# EAGLE schematic p2n-001 (EAGLE 9.6.2)
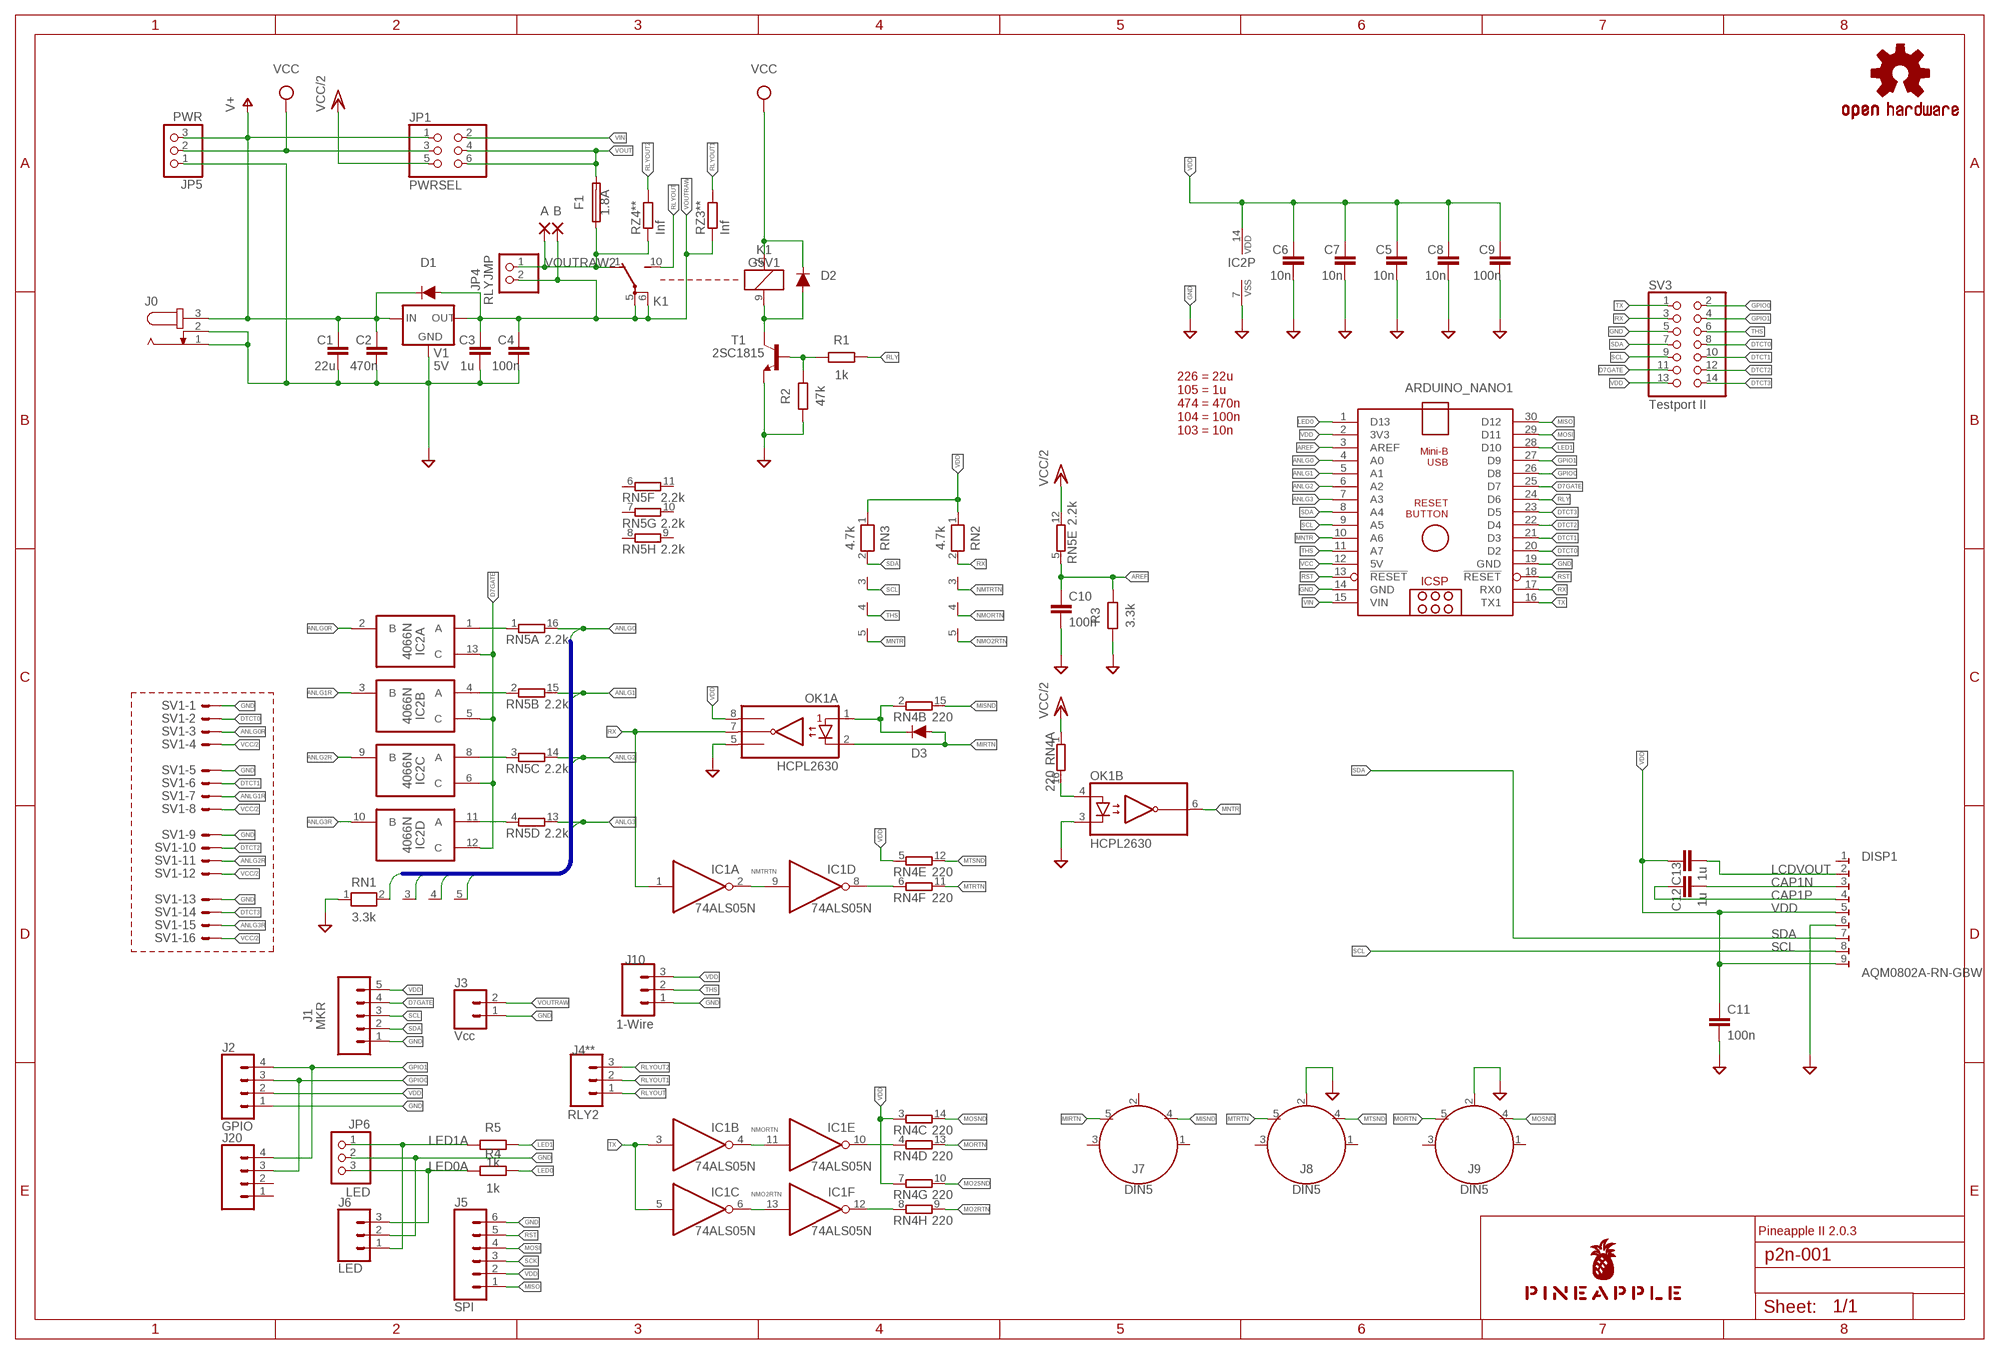
[diagram p0: schematic, sheet 1]

## Parts
A  SMD2  [SMD1,27-2,54]
ARDUINO_NANO1  ARDUINO_NANO  [ARDUINO_NANO]
B  SMD2  [SMD1,27-2,54]
C1  22u  C-EU025-050X050  [C025-050X050]
C2  470n  C-EU050-024X044  [C050-024X044]
C3  1u  C-EU050-024X044  [C050-024X044]
C4  100n  C-EU025-024X044  [C025-024X044]
C5  10n  C-EU025-024X044  [C025-024X044]
C6  10n  C-EU025-024X044  [C025-024X044]
C7  10n  C-EU025-024X044  [C025-024X044]
C8  10n  C-EU025-024X044  [C025-024X044]
C9  100n  C-EU025-024X044  [C025-024X044]
C10  100n  C-EU025-024X044  [C025-024X044]
C11  100n  C-EU025-024X044  [C025-024X044]
C12  1u  C-EU050-024X044  [C050-024X044]
C13  1u  C-EU050-024X044  [C050-024X044]
D1  DIODE-1N4148  [DIODE-1N4148]
D2  DIODE-1N4148  [DIODE-1N4148]
D3  DIODE-1N4148  [DIODE-1N4148]
DISP1  AQM0802A-RN-GBW  [AQM0802A-RN-GBW-FOOTPRINT]
F1  1.8A  TE5  [TE5]
IC1  74ALS05N  [DIL14]
IC2  4066N  [DIL14]
J0  JACK-PLUG0  [SPC4077]
J1  MKR  CONN_05JST  [JST-5-PTH]
J2  GPIO  CONN_04JST-PTH  [JST-4-PTH]
J3  Vcc  CONN_02JST-PTH-2  [JST-2-PTH]
J4**  RLY2  CONN_03JST-PTH-NS  [JST-3-PTH-NS]
J5  SPI  CONN_061.27MM  [1X06_1.27MM]
J6  LED  CONN_03JST-PTH-VERT  [JST-3-PTH-VERT]
J7  DIN5  [DIN5-RA-PTH]
J8  DIN5  [DIN5-RA-PTH]
J9  DIN5  [DIN5-RA-PTH]
J10  1-Wire  CONN_03JST-PTH-VERT  [JST-3-PTH-VERT]
J20  CONN_041.27MM  [1X04_1.27MM]
JP1  PWRSEL  PINHD-2X3  [2X03]
JP4  RLYJMP  PINHD-1X2  [1X02]
JP5  PWR  PINHD-1X3  [1X03]
JP6  LED  PINHD-1X3  [1X03]
K1  G5V1  [G5V1]
LOGO1  OSHW-LOGOS-COPPER  [OSHW-LOGO-S_COPPER]
OK1  HCPL2630  [DIL08]
R1  1k  R-EU_0204/5  [0204/5]
R2  47k  R-EU_0204/5  [0204/5]
R3  3.3k  R-EU_0204/5  [0204/5]
R4  1k  R-EU_0204/5  [0204/5]
R5  1k  R-EU_0204/5  [0204/5]
RN1  3.3k  RN04  [RN-5]
RN2  4.7k  RN04  [RN-5]
RN3  4.7k  RN04  [RN-5]
RN4  220  8R-N  [DIL16]
RN5  2.2k  8R-N  [DIL16]
RZ3**  Inf  R-EU_M2012  [M2012]
RZ4**  Inf  R-EU_M2012  [M2012]
SV1  ML16LE  [ML16L]
SV3  Testport II  PINHD-2X7  [2X07]
T1  2SC1815  [TO92-ECB]
U$1  PINEAPPLE450_SILK  [PINEAPPLE450_SILK]
V1  5V  78XXL  [78XXL]

## Nets
ANLG0 [analog]: ARDUINO_NANO1.4(A0) RN1.2 RN5.16
ANLG0R [analog]: IC2.2(A:B) SV1.3
ANLG1 [analog]: ARDUINO_NANO1.5(A1) RN1.3 RN5.15
ANLG1R [analog]: IC2.3(B:B) SV1.7
ANLG2 [analog]: ARDUINO_NANO1.6(A2) RN1.4 RN5.14
ANLG2R [analog]: IC2.9(C:B) SV1.11
ANLG3 [analog]: ARDUINO_NANO1.7(A3) RN1.5 RN5.13
ANLG3R [analog]: IC2.10(D:B) SV1.15
AREF: ARDUINO_NANO1.3(AREF) C10.1 R3.2 RN5.5
CAP1N: C12.2 DISP1.3
CAP1P: C12.1 DISP1.4
D7GATE: ARDUINO_NANO1.25(D7) IC2.5(B:C) IC2.6(C:C) IC2.12(D:C) IC2.13(A:C) J1.4 SV3.11
DTCT0: ARDUINO_NANO1.20(D2) SV1.2 SV3.8
DTCT1: ARDUINO_NANO1.21(D3) SV1.6 SV3.10
DTCT2: ARDUINO_NANO1.22(D4) SV1.10 SV3.12
DTCT3: ARDUINO_NANO1.23(D5) SV1.14 SV3.14
GND [gnd]: ARDUINO_NANO1.14(GND) ARDUINO_NANO1.19(GND) C1.2 C2.2 C3.2 C4.2 C5.2 C6.2 C7.2 C8.2 C9.2 C10.2 C11.2 DISP1.6 IC2.7(P:VSS) J0.1 J0.2 J1.1 J2.1 J3.1 J5.6 J6.2 J8.2 J9.2 J10.1 JP5.1 JP6.2 OK1.3(B:C2) OK1.5(A:GND) R2.1 R3.1 RN1.1 SV1.1 SV1.5 SV1.9 SV1.13 SV3.5 T1.E V1.GND
GPIO0: ARDUINO_NANO1.26(D8) J2.3 J20.3 SV3.2
GPIO1: ARDUINO_NANO1.27(D9) J2.4 J20.4 SV3.4
LCDVOUT: C13.2 DISP1.2
LED0: ARDUINO_NANO1.1(D13) R4.2
LED0A: J6.3 JP6.3 R4.1
LED1: ARDUINO_NANO1.28(D10) R5.2
LED1A: J6.1 JP6.1 R5.1
MIDIINSND: D3.C OK1.1(A:A1) RN4.2
MIRTN: D3.A J7.5 OK1.2(A:C1)
MISND: J7.4 RN4.15
MISO: ARDUINO_NANO1.30(D12) J5.1
MNTR: ARDUINO_NANO1.10(A6) OK1.6(B:VO2) RN3.5
MNTRA: OK1.4(B:A2) RN4.16
MO2RTN: RN4.9
MO2RTNRAW: IC1.12(F:O) RN4.8
MO2SND: RN4.10
MORTN: J9.5 RN4.13
MORTNRAW: IC1.10(E:O) RN4.4
MOSI: ARDUINO_NANO1.29(D11) J5.4
MOSND: J9.4 RN4.14
MTRTN: J8.5 RN4.11
MTRTNRAW: IC1.8(D:O) RN4.6
MTSND: J8.4 RN4.12
N$1: IC2.1(A:A) RN5.1
N$2: IC2.4(B:A) RN5.2
N$3: IC2.8(C:A) RN5.3
N$4: IC2.11(D:A) RN5.4
NMO2RTN: IC1.6(C:O) IC1.13(F:I) RN2.5
NMORTN: IC1.4(B:O) IC1.11(E:I) RN2.4
NMTRTN: IC1.2(A:O) IC1.9(D:I) RN2.3
RLY: ARDUINO_NANO1.24(D6) R1.2
RLYDRV: R1.1 R2.2 T1.B
RLYOUT: J4**.1 K1.10(2:S)
RLYOUT1: J4**.2 RZ3**.2
RLYOUT2: J4**.3 RZ4**.2
RLYSNK: D2.A K1.9 T1.C
RST: ARDUINO_NANO1.13(!RESET) ARDUINO_NANO1.18(!RESET) J5.5
RX: ARDUINO_NANO1.17(RX0) IC1.1(A:I) OK1.7(A:VO1) RN2.2 SV3.3
SCK: J5.3
SCL: ARDUINO_NANO1.9(A5) DISP1.8 J1.3 RN3.3 SV3.9
SDA: ARDUINO_NANO1.8(A4) DISP1.7 J1.2 RN3.2 SV3.7
THS: ARDUINO_NANO1.11(A7) J10.2 RN3.4 SV3.6
TX: ARDUINO_NANO1.16(TX1) IC1.3(B:I) IC1.5(C:I) SV3.1
V+ [superpower]: C1.1 C2.1 D1.C J0.3 JP1.1 JP5.3 V1.IN
VCC [power]: ARDUINO_NANO1.12(5V) D2.C JP1.3 JP5.2 K1.2
VCC/2 [superpower]: JP1.5 RN4.1 RN5.12 SV1.4 SV1.8 SV1.12 SV1.16
VDD [power]: ARDUINO_NANO1.2(3V3) C5.1 C6.1 C7.1 C8.1 C9.1 C11.1 C13.1 DISP1.5 DISP1.9 IC2.14(P:VDD) J1.5 J2.2 J5.2 J10.3 OK1.8(A:VCC) RN2.1 RN3.1 RN4.3 RN4.5 RN4.7 SV3.13
VIN [superpower]: ARDUINO_NANO1.15(VIN) JP1.2
VOUT [superpower]: F1.2 JP1.4 JP1.6
VOUTRAW [superpower]: B.1(P) C3.1 C4.1 D1.A J3.2 JP4.2 K1.5(2:P) K1.6(2:P) RZ3**.1 V1.OUT
VOUTRAW2 [superpower]: A.1(P) F1.1 JP4.1 K1.1(2:O) RZ4**.1
Unconnected: DISP1.1 J7.1 J7.2 J7.3 J8.1 J8.3 J9.1 J9.3 J20.1 J20.2 RN5.6 RN5.7 RN5.8 RN5.9 RN5.10 RN5.11

## Buses
ANLG[0..3]

## Notes on the sheet
- 226 = 22u
  105 = 1u
  474 = 470n
  104 = 100n
  103 = 10n
- Pineapple II 2.0.3

## Power pins joined to a net without a drawn wire
GND: IC1.7(P:GND)
VCC: IC1.14(P:VCC)

## Library data of the parts
A B = wirepad:SMD2: SMD PAD
ARDUINO_NANO1 = ArduinoNanoV30:ARDUINO_NANO: Arduino Nano V3.0 Overview: The Arduino Nano is a small, complete, and breadboard-friendly board based on the ATmega328 (Arduino Nano 3.x) or ATmega168 (Arduino Nano 2.x). It has more or less the same functionality of the Arduino Duemilanove, but in a different package. It lacks only a DC power jack, and works with a Mini-B USB cable instead of a standard one. The Nano was designed and is being produced by Gravitech. Specifications: Microcontroller Atmel ATmega168 or ATmega328 Operating Voltage (logic level) 5 V Input Voltage (recommended) 7-12 V Input Voltage (limits) 6-20 V Digital I/O Pins 14 (of which 6 provide PWM output) Analog Input Pins 8 DC Current per I/O Pin 40 mA Flash Memory 16 KB (ATmega168) or 32 KB (ATmega328) of which 2 KB used by bootloader SRAM 1 KB (ATmega168) or 2 KB (ATmega328) EEPROM 512 bytes (ATmega168) or 1 KB (ATmega328) Clock Speed 16 MHz Dimensions 0.73" x 1.70" Length 45 mm Width 18 mm Weigth 5 g Power: The Arduino Nano can be powered via the Mini-B USB connection, 6-20V unregulated external power supply (pin 30), or 5V regulated external power supply (pin 27). The power source is automatically selected to the highest voltage source. Memory: The ATmega168 has 16 KB of flash memory for storing code (of which 2 KB is used for the bootloader); the ATmega328 has 32 KB, (also with 2 KB used for the bootloader). The ATmega168 has 1 KB of SRAM and 512 bytes of EEPROM (which can be read and written with the EEPROM library); the ATmega328 has 2 KB of SRAM and 1 KB of EEPROM. Input and Output: Each of the 14 digital pins on the Nano can be used as an input or output, using pinMode(), digitalWrite(), and digitalRead() functions. They operate at 5 volts. Each pin can provide or receive a maximum of 40 mA and has an internal pull-up resistor (disconnected by default) of 20-50 kOhms. In addition, some pins have specialized functions. Visit Arduino - ArduinoBoardNano <https://www.arduino.cc/en/Main/ArduinoBoardNano>
C1-C4 C10-C13 = rcl:C-EU: CAPACITOR, European symbol; SPICEPREFIX: C
C5-C9 = resistor:C-EU: CAPACITOR, European symbol
D1-D3 = SparkFun-DiscreteSemi:DIODE: Diode These are standard reverse protection diodes and small signal diodes. SparkFun Products: SparkFun SparkPunk Sound Kit <https://www.sparkfun.com/products/11177> SparkFun ESP8266 Thing <https://www.sparkfun.com/products/13231>; PROD_ID: DIO-08378; VALUE: 200mA/100V/1V
DISP1 = AQM0802A-RN-GBW:AQM0802A-RN-GBW: AQM0802A-RN-GBW LCD
F1 = fuse:TE5: FUSE Wickmann; OC_FARNELL: unknown; OC_NEWARK: unknown
IC1 = 74xx-us:74*05: Hex INVERTER, open collector
IC2 = 40xx:4066: Quad bilateral ANALOG SWITCH
J0 = con-jack:JACK-PLUG: DC POWER JACK Power Jack, DC, Right Angle, Through Hole, Rated 5A at 16VDC, PC Terminals Distributor: Farnell (www.Farnell.de) Drawing: 84N1161.pdf / 84N1162.pdf Manufacturer: SPC Technology (www.spctechnology.com) Type: SPC4077 / SPC 4078; OC_FARNELL: unknown; OC_NEWARK: unknown
J1 = SparkFun-Connectors:CONN_05: Multi connection point. Often used as Generic Header-pin footprint for 0.1 inch spaced/style header connections On any of the 0.1 inch spaced packages, you can populate with these: Break Away Headers - Straight <https://www.sparkfun.com/products/116> (PRT-00116) Break Away Male Headers - Right Angle <https://www.sparkfun.com/products/553> (PRT-00553) Female Headers <https://www.sparkfun.com/products/115> (PRT-00115) Break Away Headers - Machine Pin <https://www.sparkfun.com/products/117> (PRT-00117) Break Away Female Headers - Swiss Machine Pin <https://www.sparkfun.com/products/743> (PRT-00743) For SCREWTERMINALS and SPRING TERMINALS visit here: Screw Terimnals on SparkFun.com <https://www.sparkfun.com/search/results?term=Screw+Terminals> (5mm/3.5mm/2.54mm spacing) This device is also useful as a general connection point to wire up your design to another part of your project. Our various solder wires solder well into these plated through hole pads. Hook-Up Wire - Assortment (Stranded, 22 AWG) <https://www.sparkfun.com/products/11375> (PRT-11375) Hook-Up Wire - Assortment (Solid Core, 22 AWG) <https://www.sparkfun.com/products/11367> (PRT-11367) View the entire wire category on our website here <https://www.sparkfun.com/categories/141> Special notes: Molex polarized connector foot print use with SKU : PRT-08231 with associated crimp pins and housings. 1MM SMD Version SKU: PRT-10208; SF_ID: PRT-09917
J2 = SparkFun-Connectors:CONN_04: Multi connection point. Often used as Generic Header-pin footprint for 0.1 inch spaced/style header connections On any of the 0.1 inch spaced packages, you can populate with these: Break Away Headers - Straight <https://www.sparkfun.com/products/116> (PRT-00116) Break Away Male Headers - Right Angle <https://www.sparkfun.com/products/553> (PRT-00553) Female Headers <https://www.sparkfun.com/products/115> (PRT-00115) Break Away Headers - Machine Pin <https://www.sparkfun.com/products/117> (PRT-00117) Break Away Female Headers - Swiss Machine Pin <https://www.sparkfun.com/products/743> (PRT-00743) For SCREWTERMINALS and SPRING TERMINALS visit here: Screw Terimnals on SparkFun.com <https://www.sparkfun.com/search/results?term=Screw+Terminals> (5mm/3.5mm/2.54mm spacing) This device is also useful as a general connection point to wire up your design to another part of your project. Our various solder wires solder well into these plated through hole pads. Hook-Up Wire - Assortment (Stranded, 22 AWG) <https://www.sparkfun.com/products/11375> (PRT-11375) Hook-Up Wire - Assortment (Solid Core, 22 AWG) <https://www.sparkfun.com/products/11367> (PRT-11367) View the entire wire category on our website here <https://www.sparkfun.com/categories/141> Special notes: Molex polarized connector foot print use with SKU : PRT-08231 with associated crimp pins and housings. 1MM SMD Version SKU: PRT-10208; PROD_ID: WIRE-13531; SF_ID: PRT-09916
J3 = SparkFun-Connectors:CONN_02: Multi connection point. Often used as Generic Header-pin footprint for 0.1 inch spaced/style header connections On any of the 0.1 inch spaced packages, you can populate with these: Break Away Headers - Straight <https://www.sparkfun.com/products/116> (PRT-00116) Break Away Male Headers - Right Angle <https://www.sparkfun.com/products/553> (PRT-00553) Female Headers <https://www.sparkfun.com/products/115> (PRT-00115) Break Away Headers - Machine Pin <https://www.sparkfun.com/products/117> (PRT-00117) Break Away Female Headers - Swiss Machine Pin <https://www.sparkfun.com/products/743> (PRT-00743) For SCREWTERMINALS and SPRING TERMINALS visit here: Screw Terimnals on SparkFun.com <https://www.sparkfun.com/search/results?term=Screw+Terminals> (5mm/3.5mm/2.54mm spacing) This device is also useful as a general connection point to wire up your design to another part of your project. Our various solder wires solder well into these plated through hole pads. Hook-Up Wire - Assortment (Stranded, 22 AWG) <https://www.sparkfun.com/products/11375> (PRT-11375) Hook-Up Wire - Assortment (Solid Core, 22 AWG) <https://www.sparkfun.com/products/11367> (PRT-11367) View the entire wire category on our website here <https://www.sparkfun.com/categories/141> Special notes: Molex polarized connector foot print use with: PRT-08233 with associated crimp pins and housings. 2.54_SCREWTERM for use with PRT-10571. 3.5mm Screw Terminal footprints for PRT-08084 5mm Screw Terminal footprints for use with PRT-08432; PROD_ID: CONN-09863; SKU: PRT-09914
J4** = SparkFun-Connectors:CONN_03: Multi connection point. Often used as Generic Header-pin footprint for 0.1 inch spaced/style header connections On any of the 0.1 inch spaced packages, you can populate with these: Break Away Headers - Straight <https://www.sparkfun.com/products/116> (PRT-00116) Break Away Male Headers - Right Angle <https://www.sparkfun.com/products/553> (PRT-00553) Female Headers <https://www.sparkfun.com/products/115> (PRT-00115) Break Away Headers - Machine Pin <https://www.sparkfun.com/products/117> (PRT-00117) Break Away Female Headers - Swiss Machine Pin <https://www.sparkfun.com/products/743> (PRT-00743) Stackable Header - 3 Pin (Female, 0.1") <https://www.sparkfun.com/products/13875> (PRT-13875) For SCREWTERMINALS and SPRING TERMINALS visit here: Screw Terimnals on SparkFun.com <https://www.sparkfun.com/search/results?term=Screw+Terminals> (5mm/3.5mm/2.54mm spacing) This device is also useful as a general connection point to wire up your design to another part of your project. Our various solder wires solder well into these plated through hole pads. Hook-Up Wire - Assortment (Stranded, 22 AWG) <https://www.sparkfun.com/products/11375> (PRT-11375) Hook-Up Wire - Assortment (Solid Core, 22 AWG) <https://www.sparkfun.com/products/11367> (PRT-11367) View the entire wire category on our website here <https://www.sparkfun.com/categories/141> Special notes: Molex polarized connector foot print use with SKU : PRT-08232 with associated crimp pins and housings.
J5 = SparkFun-Connectors:CONN_06: Multi connection point. Often used as Generic Header-pin footprint for 0.1 inch spaced/style header connections On any of the 0.1 inch spaced packages, you can populate with these: Break Away Headers - Straight <https://www.sparkfun.com/products/116> (PRT-00116) Break Away Male Headers - Right Angle <https://www.sparkfun.com/products/553> (PRT-00553) Female Headers <https://www.sparkfun.com/products/115> (PRT-00115) Break Away Headers - Machine Pin <https://www.sparkfun.com/products/117> (PRT-00117) Break Away Female Headers - Swiss Machine Pin <https://www.sparkfun.com/products/743> (PRT-00743) Arduino Stackable Header - 6 Pin <https://www.sparkfun.com/products/9280> (PRT-09280) For SCREWTERMINALS and SPRING TERMINALS visit here: Screw Terimnals on SparkFun.com <https://www.sparkfun.com/search/results?term=Screw+Terminals> (5mm/3.5mm/2.54mm spacing) This device is also useful as a general connection point to wire up your design to another part of your project. Our various solder wires solder well into these plated through hole pads. Hook-Up Wire - Assortment (Stranded, 22 AWG) <https://www.sparkfun.com/products/11375> (PRT-11375) Hook-Up Wire - Assortment (Solid Core, 22 AWG) <https://www.sparkfun.com/products/11367> (PRT-11367) View the entire wire category on our website here <https://www.sparkfun.com/categories/141>
J6 J10 = SparkFun-Connectors:CONN_03: Multi connection point. Often used as Generic Header-pin footprint for 0.1 inch spaced/style header connections On any of the 0.1 inch spaced packages, you can populate with these: Break Away Headers - Straight <https://www.sparkfun.com/products/116> (PRT-00116) Break Away Male Headers - Right Angle <https://www.sparkfun.com/products/553> (PRT-00553) Female Headers <https://www.sparkfun.com/products/115> (PRT-00115) Break Away Headers - Machine Pin <https://www.sparkfun.com/products/117> (PRT-00117) Break Away Female Headers - Swiss Machine Pin <https://www.sparkfun.com/products/743> (PRT-00743) Stackable Header - 3 Pin (Female, 0.1") <https://www.sparkfun.com/products/13875> (PRT-13875) For SCREWTERMINALS and SPRING TERMINALS visit here: Screw Terimnals on SparkFun.com <https://www.sparkfun.com/search/results?term=Screw+Terminals> (5mm/3.5mm/2.54mm spacing) This device is also useful as a general connection point to wire up your design to another part of your project. Our various solder wires solder well into these plated through hole pads. Hook-Up Wire - Assortment (Stranded, 22 AWG) <https://www.sparkfun.com/products/11375> (PRT-11375) Hook-Up Wire - Assortment (Solid Core, 22 AWG) <https://www.sparkfun.com/products/11367> (PRT-11367) View the entire wire category on our website here <https://www.sparkfun.com/categories/141> Special notes: Molex polarized connector foot print use with SKU : PRT-08232 with associated crimp pins and housings.; PROD_ID: CONN-13230
J7-J9 = SparkFun-Connectors:DIN5: DIN5 Connector - Female Right Angle (frequently used as a MIDI Jack connector) This type of connector and cable is frequently used for transmitting midi data (musical instrument digital interface). It is what you usually see on a keyboard or set of electronic drums. Learn more here <https://en.wikipedia.org/wiki/MIDI>. For more information on the pinout and electrical specifications of MIDI communications, please see the following resource: https://www.midi.org/specifications/item/midi-din-electrical-specification Here is the connector we sell at SparkFun: MIDI Connector - Female Right Angle <https://www.sparkfun.com/products/9536> (PRT-09536) Datasheet <hhttp://www.sparkfun.com/datasheets/Prototyping/Connectors/MIDI-RA.pdf> It is used on this SparkFun product: SparkFun MIDI Shield <https://www.sparkfun.com/products/12898> (DEV-12898); PROD_ID: CONN-09481
J20 = SparkFun-Connectors:CONN_04: Multi connection point. Often used as Generic Header-pin footprint for 0.1 inch spaced/style header connections On any of the 0.1 inch spaced packages, you can populate with these: Break Away Headers - Straight <https://www.sparkfun.com/products/116> (PRT-00116) Break Away Male Headers - Right Angle <https://www.sparkfun.com/products/553> (PRT-00553) Female Headers <https://www.sparkfun.com/products/115> (PRT-00115) Break Away Headers - Machine Pin <https://www.sparkfun.com/products/117> (PRT-00117) Break Away Female Headers - Swiss Machine Pin <https://www.sparkfun.com/products/743> (PRT-00743) For SCREWTERMINALS and SPRING TERMINALS visit here: Screw Terimnals on SparkFun.com <https://www.sparkfun.com/search/results?term=Screw+Terminals> (5mm/3.5mm/2.54mm spacing) This device is also useful as a general connection point to wire up your design to another part of your project. Our various solder wires solder well into these plated through hole pads. Hook-Up Wire - Assortment (Stranded, 22 AWG) <https://www.sparkfun.com/products/11375> (PRT-11375) Hook-Up Wire - Assortment (Solid Core, 22 AWG) <https://www.sparkfun.com/products/11367> (PRT-11367) View the entire wire category on our website here <https://www.sparkfun.com/categories/141> Special notes: Molex polarized connector foot print use with SKU : PRT-08231 with associated crimp pins and housings. 1MM SMD Version SKU: PRT-10208
JP1 = pinhead:PINHD-2X3: PIN HEADER
JP4 = pinhead:PINHD-1X2: PIN HEADER
JP5 JP6 = pinhead:PINHD-1X3: PIN HEADER
K1 = relay:G5V1: RELAY 1 x switch, 0.5 A/125 V AC, 1 A/24 V DC , Omron; MPN: G5V-1-DC24; OC_FARNELL: 9949593; OC_NEWARK: 36M6377
LOGO1 = SparkFun-Aesthetics:OSHW-LOGO: Open-Source Hardware (OSHW) Logo This logo indicates the piece of hardware it is found on incorporates a OSHW license and/or adheres to the definition of open source hardware found here: http://freedomdefined.org/OSHW
OK1 = optocoupler:HCPL2630: HEWLETT PACKARD OPTO COUPLER; MF: AGILENT TECHNOLOGIES; MPN: HCPL-2630-000E; OC_FARNELL: 9994904; OC_NEWARK: 88H7813
R1-R5 = resistor:R-EU_: RESISTOR, European symbol
RN1-RN3 = resistor-net:RN04: RESISTOR NETWORK; OC_FARNELL: unknown; OC_NEWARK: unknown
RN4 RN5 = resistor-dil:8R-N: DIL RESISTOR; OC_FARNELL: unknown; OC_NEWARK: unknown
RZ3** RZ4** = rcl:R-EU_: RESISTOR, European symbol; SPICEPREFIX: R
SV1 = con-ml:ML16LE: HARTING; OC_FARNELL: unknown; OC_NEWARK: unknown
SV3 = pinhead:PINHD-2X7: PIN HEADER
T1 = transistor:2SC1815: NPN EPITAXIAL TRANSISTOR Source: TOSHIBA .. 2SC1815 1.pdf
U$1 = pineapple:PINEAPPLE450_SILK
V1 = v-reg:78XXL: VOLTAGE REGULATOR

## Net classes
0 default: width 0.152 mm, drill 0.152 mm, clearance 0.152 mm
1 gnd: width 0.305 mm, drill 0.152 mm, clearance 0.152 mm
2 power: width 0.508 mm, drill 0.152 mm, clearance 0.152 mm
3 analog: width 0.305 mm, drill 0.152 mm, clearance 0.152 mm
4 superpower: width 1.016 mm, drill 0.152 mm, clearance 0.152 mm